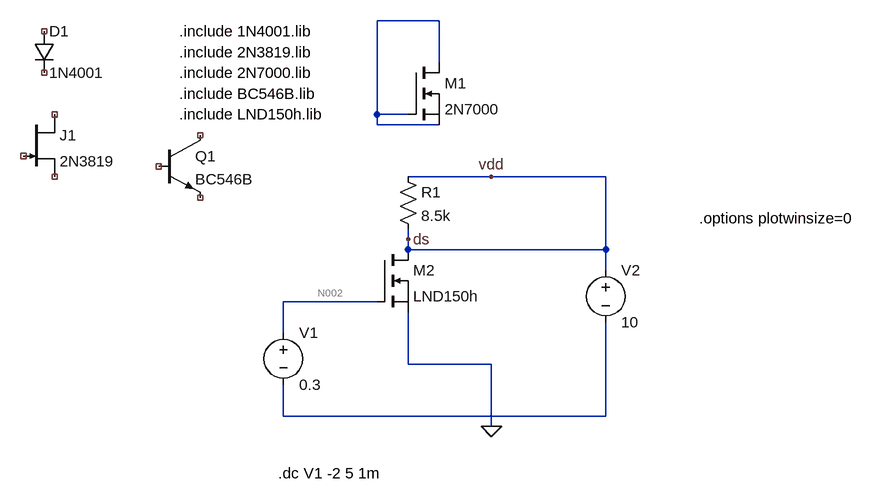
[diagram p0: schematic TP_FE mos2N7000.asc]
* TP_FE mos2N7000.asc
D1 NC_01 NC_02 1N4001
J1 NC_03 NC_04 NC_05 2N3819
Q1 NC_06 NC_07 NC_08 0 BC546B
M1 N001 N001 N001 N001 2N7000
M2 ds N002 0 0 LND150h
V1 N002 N003 0.3
V2 ds N003 10
R1 ds ds 8.5k
.model D D
.lib standard.dio
.model NPN NPN
.model PNP PNP
.lib standard.bjt
.model NJF NJF
.model PJF PJF
.lib standard.jft
.model NMOS NMOS
.model PMOS PMOS
.lib standard.mos
.include 1N4001.lib
.include 2N3819.lib
.include 2N7000.lib
.include BC546B.lib
.include LND150h.lib
.dc V1 -2 5 1m
.options plotwinsize=0
.backanno
.end

* Results of the author's LTspice run, read from the files saved beside the schematic
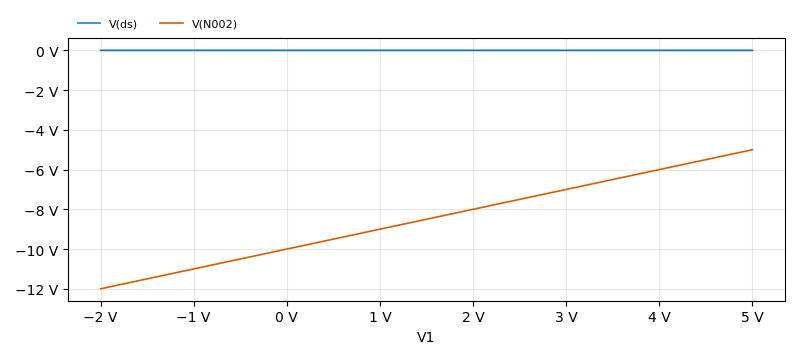
[diagram p1: DC transfer characteristic of TP_FE mos2N7000.asc, plotted from the saved traces]
* DC transfer characteristic, 1 run:
*   V(ds): -35.71 nV at V1=-2 V, 8.928 nV at V1=5 V, min -64.22 nV, max 74.63 nV
*   V(N002): -12 V at V1=-2 V, -5 V at V1=5 V, min -12 V, max -5 V